# EAGLE design nrf24_shim (EAGLE 7.4.0)
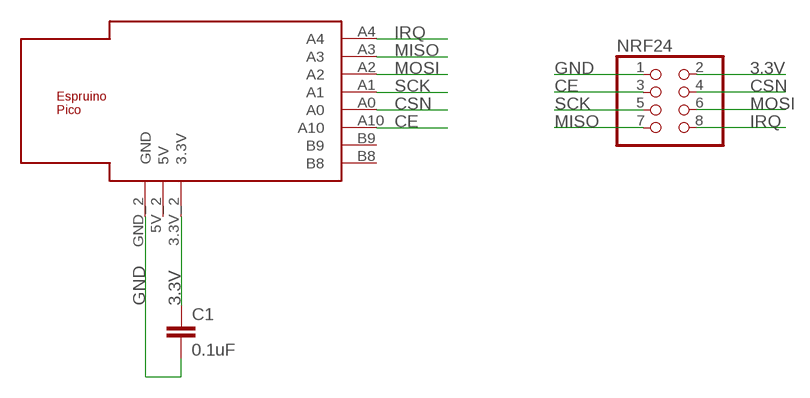
[diagram p0: schematic, sheet 1]

## Parts
C1  0.1uF  C-EUC1206  [C1206]
NRF24  PINHD-2X4  [2X04]
U$1  ESPRUINO_PICO_0.05_SMALL  [ESPRUINO_PICO_0.05_SMALL]

## Nets
3.3V: C1.1 NRF24.2 U$1.3.3V_2(3.3V)
CE: NRF24.3 U$1.A10
CSN: NRF24.4 U$1.A0
GND: C1.2 NRF24.1 U$1.GND_2(GND)
IRQ: NRF24.8 U$1.A4
MISO: NRF24.7 U$1.A3
MOSI: NRF24.6 U$1.A2
SCK: NRF24.5 U$1.A1
Unconnected: U$1.5V_2(5V) U$1.B8 U$1.B9

## Library data of the parts
C1 = rcl:C-EU: CAPACITOR, European symbol
NRF24 = pinhead:PINHD-2X4: PIN HEADER
U$1 = espruino_pico:ESPRUINO_PICO_0.05_SMALL

## Net classes
0 default: width 0.305 mm

## Board
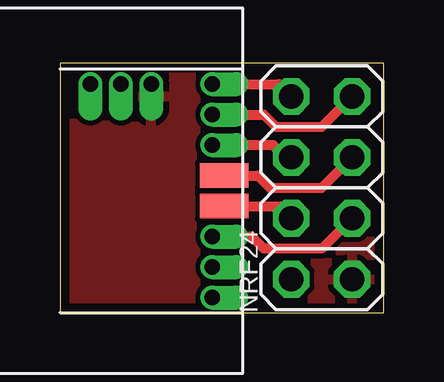
[diagram p1: board, top side]
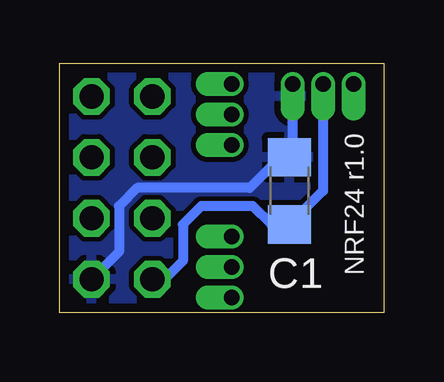
[diagram p2: board, bottom side, seen from below]

Size 13.51 x 10.4 mm. Coordinates in mm from the lower left corner, seen from the top.
Outline: 0,0 13.51,0 13.51,10.4 0,10.4 0,0
Copper layers (1*16): Top 0.0356mm / dielectric 1.5011mm / Bottom 0.0356mm
Design rules "oshpark": minimum track width 10mil, minimum drill 13mil, track to track 8mil, track to pad 6mil, pad to pad 6mil, via to via 6mil, smd to smd 6mil, copper to edge 15mil, drill to drill 6mil, minimum pad ring 7mil, minimum via ring 7mil, stop-mask expansion 4mil, vias tented up to drill 15mil, thermal gap 10mil

### Footprints (pad centres in the part's own frame; a part is rotated, then mirrored left to right if it is on the bottom)
C1206 = smd 1.6 x 1.8: 1 -1.4,0; 2 1.4,0
2X04 = drill 1.016 octagon: 1 -3.81,-1.27; 2 -3.81,1.27; 3 -1.27,-1.27; 4 -1.27,1.27; 5 1.27,-1.27; 6 1.27,1.27; 7 3.81,-1.27; 8 3.81,1.27
ESPRUINO_PICO_0.05_SMALL = drill 0.65 pad 0.965 offset: 3.3V_2 1.27,4.445; 5V_2 0,4.445; A2 5.08,1.905; A3 5.08,3.175; A4 5.08,4.445; A10 5.08,-1.905; B8 5.08,-4.445; B9 5.08,-3.175; GND_2 2.54,4.445 | smd 2.032 x 1.016: A0 5.588,-0.635; A1 5.588,0.635

### Placement (x,y rotation side)
C1  3.94,5.08 90 bottom
NRF24  10.92,5.21 90 top
U$1  1.27,5.08 0 top

### Tracks (layer width: path | path; a pad name or v marks a point on that pad's centre or on a via)
3.3V
  Bottom 0.406: U$1.3.3V_2 2.54,5.08 C1.1 4.7,3.68 5.46,4.45 7.62,4.45 8.38,3.68 8.38,2.16 9.14,1.4 NRF24.2
CE
  Top 0.406: NRF24.3 10.92,2.67 8.51,2.67 8,3.17 U$1.A10
CSN
  Top 0.406: U$1.A0 9.65,4.45 NRF24.4
GND
  Bottom 0.406: U$1.GND_2 3.81,6.61 C1.2 4.32,6.48 5.59,5.21 10.29,5.21 11.05,4.45 11.05,2.54 NRF24.1
  pour Bottom: 0,10.41 13.59,10.41 13.59,0 0,0
  pour Top: 0,10.41 13.59,10.41 13.59,0 0,0
IRQ
  Top 0.406: U$1.A4 9.14,9.53 NRF24.8
MISO
  Top 0.406: U$1.A3 8.51,8.26 9.02,7.75 10.92,7.75 NRF24.7
MOSI
  Top 0.406: NRF24.6 9.4,6.48 8.89,6.99 U$1.A2
SCK
  Top 0.406: U$1.A1 8.26,5.71 8.76,5.21 10.92,5.21 NRF24.5

### Text on the board
bNames: NRF24 r1.0